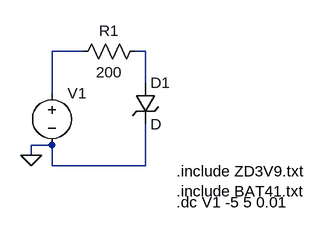
[diagram p0: schematic 121_ZD3v9.asc]
121_ZD3v9.asc, the LTspice schematic file:
Version 4
SHEET 1 880 680
WIRE 224 240 176 240
WIRE 320 240 304 240
WIRE 320 288 320 240
WIRE 176 304 176 240
WIRE 176 384 144 384
WIRE 144 400 144 384
WIRE 176 416 176 384
WIRE 320 416 320 352
WIRE 320 416 176 416
FLAG 144 400 0
SYMBOL voltage 176 288 R0
SYMATTR InstName V1
SYMATTR Value ""
SYMBOL Res 320 224 R90
WINDOW 0 0 56 VBottom 2
WINDOW 3 32 56 VTop 2
SYMATTR InstName R1
SYMATTR Value 200
SYMBOL zener 304 288 R0
SYMATTR InstName D1
TEXT 368 472 Left 2 !.dc V1 -5 5 0.01
TEXT 368 424 Left 2 !.include ZD3V9.txt\n.include BAT41.txt

The netlist it stands for:
* 121_ZD3v9.asc
V1 N001 0
R1 N002 N001 200
D1 N002 0 D
.model D D
.lib standard.dio
.dc V1 -5 5 0.01
.include ZD3V9.txt
.include BAT41.txt
.backanno
.end